# EAGLE design robot (EAGLE 6.4)
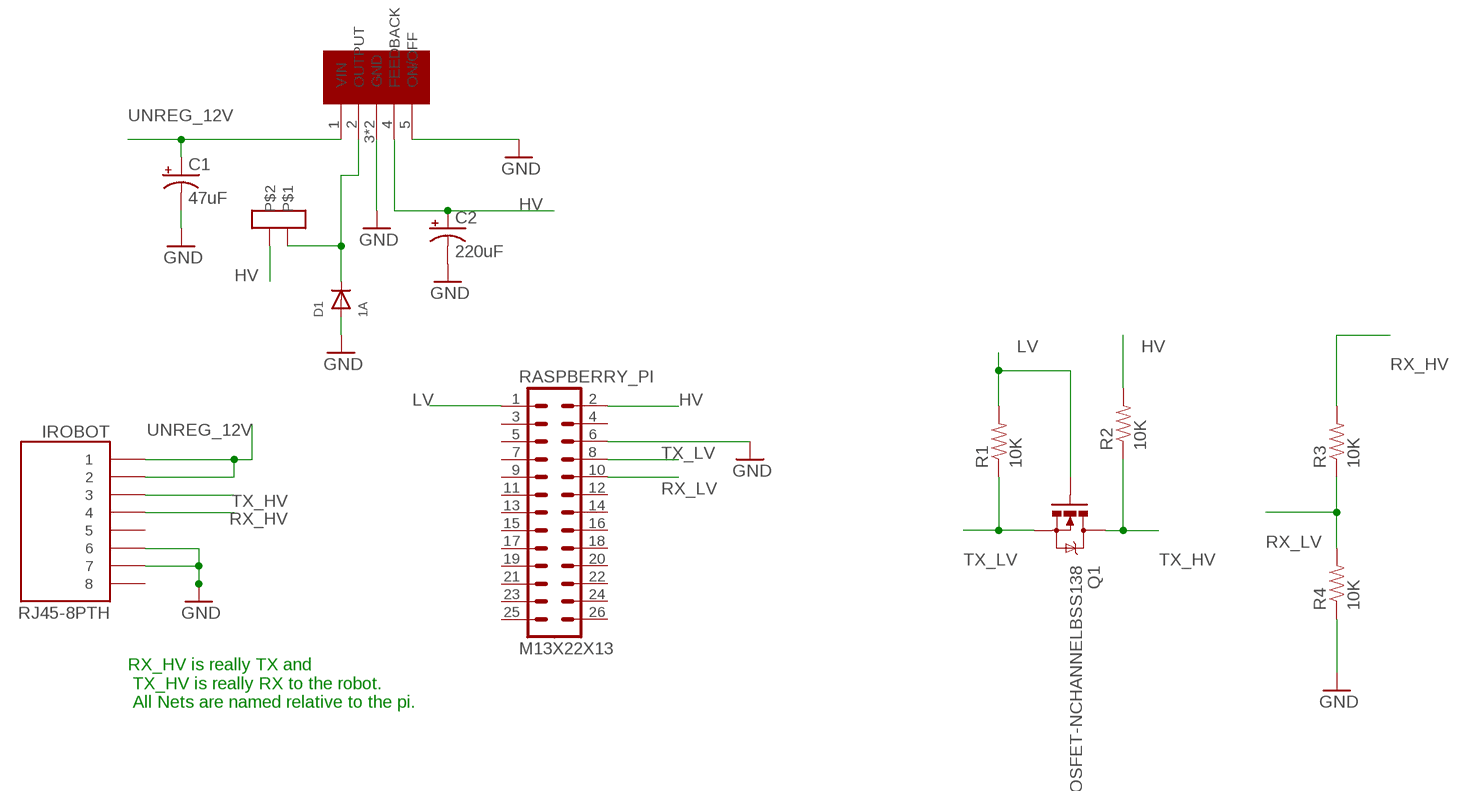
[diagram p0: schematic, sheet 1]

## Parts
C1  47uF  CAP_POLD  [PANASONIC_D]
C2  220uF  CAP_POLD  [PANASONIC_D]
D1  1A  DIODESOD-123  [SOD-123]
IROBOT  RJ45-8PTH  [RJ45-8]
Q1  MOSFET-NCHANNELBSS138  [SOT23]
R1  10K  RESISTOR0805-RES  [0805]
R2  10K  RESISTOR0805-RES  [0805]
R3  10K  RESISTOR0805-RES  [0805]
R4  10K  RESISTOR0805-RES  [0805]
RASPBERRY_PI  M13X22X13  [2X13]
U$1  TL2575  [TO-263]
U$2  PE-52627NL  [PE-52627NL]

## Nets
GND: C1.- C2.- D1.A IROBOT.6 IROBOT.7 R4.1 RASPBERRY_PI.6 U$1.3(GND) U$1.5(ON/OFF) U$1.6(GND)
HV: C2.+ R2.2 RASPBERRY_PI.2 U$1.4(FEEDBACK) U$2.P$2
LV: Q1.1(G) R1.2 RASPBERRY_PI.1
N$1: D1.C U$1.2(OUTPUT) U$2.P$1
RX_HV: IROBOT.4 R3.2
RX_LV: R3.1 R4.2 RASPBERRY_PI.10
TX_HV: IROBOT.3 Q1.3(D) R2.1
TX_LV: Q1.2(S) R1.1 RASPBERRY_PI.8
UNREG_12V: C1.+ IROBOT.1 IROBOT.2 U$1.1(VIN)
Unconnected: IROBOT.5 IROBOT.8 RASPBERRY_PI.3 RASPBERRY_PI.4 RASPBERRY_PI.5 RASPBERRY_PI.7 RASPBERRY_PI.9 RASPBERRY_PI.11 RASPBERRY_PI.12 RASPBERRY_PI.13 RASPBERRY_PI.14 RASPBERRY_PI.15 RASPBERRY_PI.16 RASPBERRY_PI.17 RASPBERRY_PI.18 RASPBERRY_PI.19 RASPBERRY_PI.20 RASPBERRY_PI.21 RASPBERRY_PI.22 RASPBERRY_PI.23 RASPBERRY_PI.24 RASPBERRY_PI.25 RASPBERRY_PI.26

## Notes on the sheet
- RX_HV is really TX and
   TX_HV is really RX to the robot.
   All Nets are named relative to the pi.

## Library data of the parts
C1 = SparkFun-Capacitors:CAP_POL: Capacitor Polarized These are standard SMD and PTH capacitors. Normally 10uF, 47uF, and 100uF in electrolytic and tantalum varieties. Always verify the external diameter of the through hole cap, it varies with capacity, voltage, and manufacturer. The EIA devices should be standard.
C2 = SparkFun-Passives:CAP_POL: Capacitor Polarized These are standard SMD and PTH capacitors. Normally 10uF, 47uF, and 100uF in electrolytic and tantalum varieties. Always verify the external diameter of the through hole cap, it varies with capacity, voltage, and manufacturer. The EIA devices should be standard.
D1 = adafruit:DIODE: Diode SMADIODE - SMA Surface Mount Package 20V 1A Schottky Diode Digikey: 641-1014-6-ND DO-1N4148 - Through Hole Small Current Diode SOD-123 20V 1 A (.5mV Vf) Schottky Diode - Digikey: MBRX120TPMSCT-ND SOD-323 10V 570mA (.38mV Vf, 3ns) Schottky Diode - Digikey: ZLLS410CT-ND SOD-523 30V 30mA Schottky Diode (RB751S-40TE61) - Digikey: RB751S-40TE61CT-ND SOT23-R/W - SOT23 Package (R = Solder Paste/Reflow Ovens, W = Hand-Soldering) BAT54Film 40V 300mA - Digikey: 497-7162-1-ND
IROBOT = SparkFun-Connectors:RJ45-8: RJ45 Jack Simple RJ45, 8-pin connection - connector for common Cat5, Cat5e, and Cat6 Ethernet cables. Footprint not yet proven in production. Connector sku is PRT-00643; Breakout PCB sku is BOB-00716.
Q1 = SparkFun-DiscreteSemi:MOSFET-NCHANNEL: Common NMOSFET Parts MFG P/N Store ID Prod ID FDD8780 TRANS-09984 SI7820DN TRANS-11055 FDS6630A IC-08089 2N7002PW TRANS-11151 FQP30N06L COM-10213 TRANS-10060 BSS123LT1G TRANS-08345 BSS138 TRANS-00830 BS170 2N7000; PROD_ID: TRANS-00830
R1-R4 = SparkFun-Resistors:RESISTOR: Resistor Basic schematic elements and footprints for 0603, 1206, and PTH resistors.
RASPBERRY_PI = SparkFun-Connectors:M13X2: 0.1" spaced headers
U$1 = TL2575:TL2575
U$2 = PE-52627NL:PE-52627NL

## Board
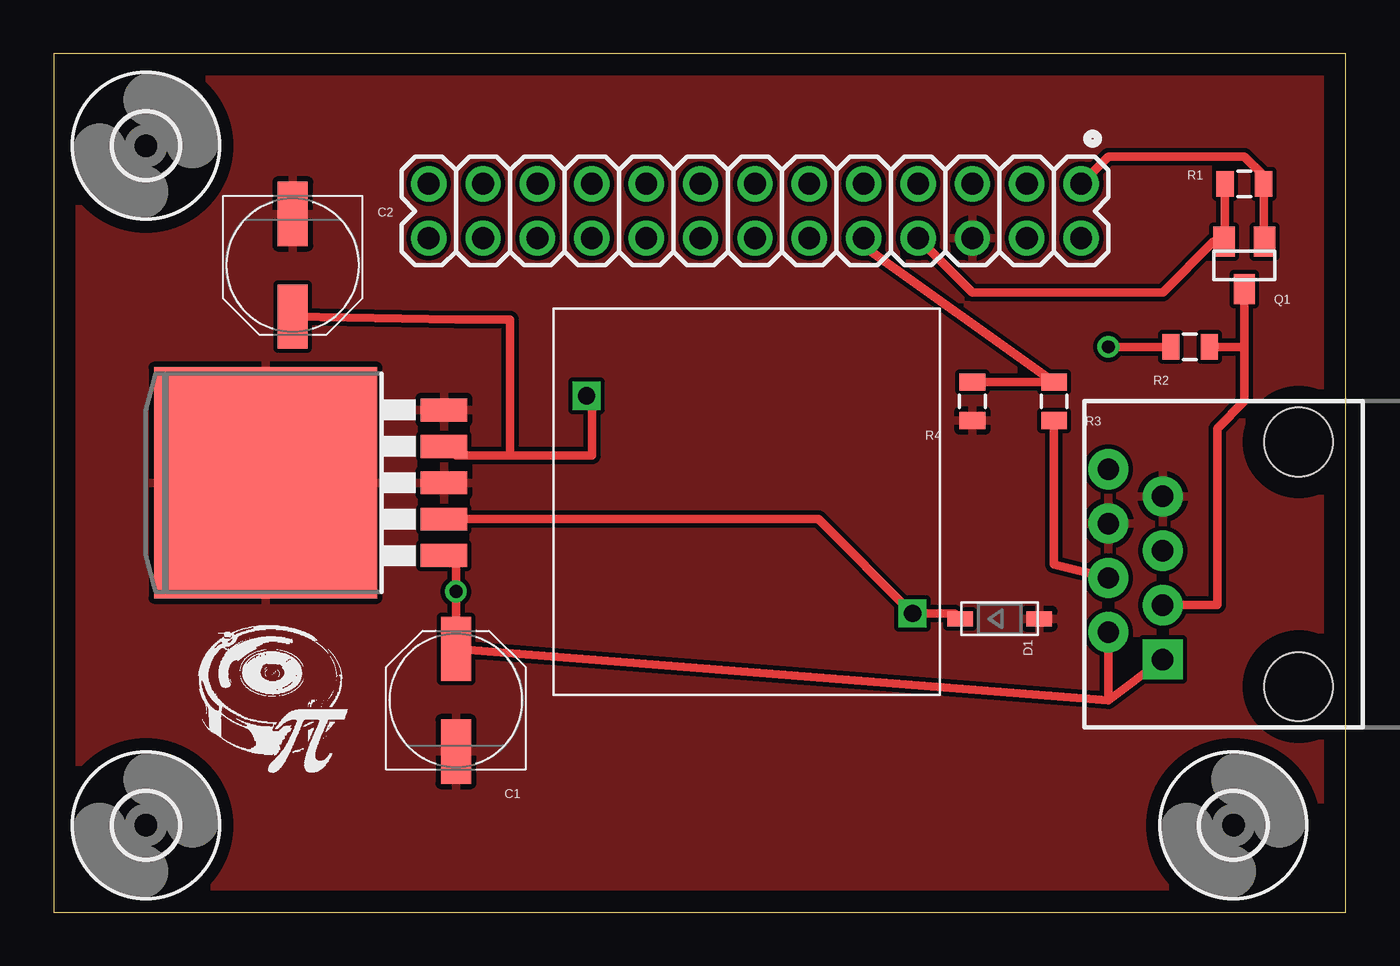
[diagram p1: board, top side]
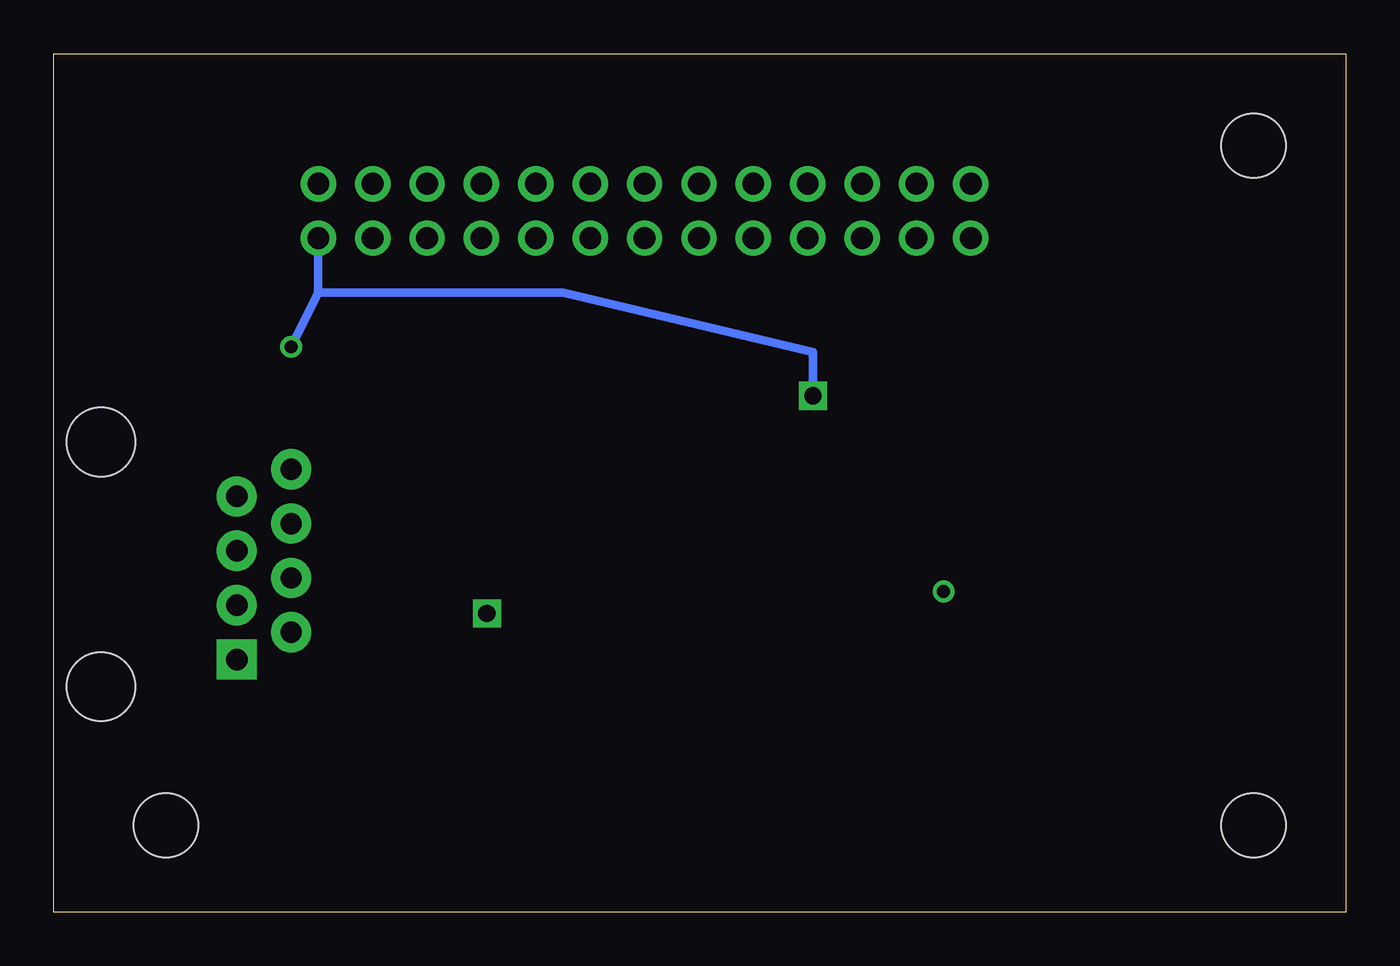
[diagram p2: board, bottom side, seen from below]

Size 60.38 x 40.12 mm. Coordinates in mm from the lower left corner, seen from the top.
Outline: 0,0 60.38,0 60.38,40.12 0,40.12 0,0
Copper layers (1*16): Top 0.035mm / dielectric 1.5mm / Bottom 0.035mm
Design rules "default": minimum track width 10mil, minimum drill 24mil, track to track 8mil, track to pad 8mil, pad to pad 8mil, via to via 8mil, smd to smd 8mil, copper to edge 40mil, drill to drill 8mil, minimum pad ring 10mil, minimum via ring 8mil, stop-mask expansion 4mil, vias tented up to drill 0mil, thermal gap 10mil

### Footprints (pad centres in the part's own frame; a part is rotated, then mirrored left to right if it is on the bottom)
PANASONIC_D = smd 3 x 1.4: + 2.4,0; - -2.4,0
SOD-123 = smd 1.2 x 0.7: A 1.85,0; C -1.85,0
RJ45-8 = drill 1 pad 1.88 square: 1 -4.445,6.35 | drill 1 pad 1.88: 2 -3.175,8.89; 3 -1.905,6.35; 4 -0.635,8.89; 5 0.635,6.35; 6 1.905,8.89; 7 3.175,6.35; 8 4.445,8.89 | hole 3.2: -5.715,0; 5.715,0
SOT23 = smd 1 x 1.4: 1 -0.95,-1.1; 2 0.95,-1.1; 3 0,1.1
0805 = smd 0.8 x 1.2: 1 -0.9,0; 2 0.9,0
2X13 = drill 1.016 pad 1.651: 1 0,0; 2 0,2.54; 3 2.54,0; 4 2.54,2.54; 5 5.08,0; 6 5.08,2.54; 7 7.62,0; 8 7.62,2.54; 9 10.16,0; 10 10.16,2.54; 11 12.7,0; 12 12.7,2.54; 13 15.24,0; 14 15.24,2.54; 15 17.78,0; 16 17.78,2.54; 17 20.32,0; 18 20.32,2.54; 19 22.86,0; 20 22.86,2.54; 21 25.4,0; 22 25.4,2.54; 23 27.94,0; 24 27.94,2.54; 25 30.48,0; 26 30.48,2.54
TO-263 = smd 1.067 x 2.159: 1 -3.404,-8.331; 2 -1.702,-8.331; 3 0,-8.331; 4 1.702,-8.331; 5 3.404,-8.331 | smd 10.8 x 10.41: 6 0,0
PE-52627NL = drill 0.8 square: P$1 -4.826,-7.366; P$2 5.334,7.874
3,0 = hole 3: 0,0

### Placement (x,y rotation side)
C1  18.8,9.91 90 top
C2  11.18,30.23 270 top
D1  44.2,13.72 0 top
IROBOT  58.17,16.26 90 top
Q1  55.63,30.23 180 top
R1  55.63,34.04 0 top
R2  53.09,26.42 180 top
R3  46.74,23.88 270 top
R4  42.93,23.88 90 top
RASPBERRY_PI  48.01,34.04 180 top
U$1  9.91,20.07 90 top
U$2  32.77,18.8 90 top
U$3  [3,0]  4.32,35.81 0 top
U$5  [3,0]  4.32,4.06 0 top
U$6  [3,0]  55.12,4.06 0 top

### Tracks (layer width: path | path; a pad name or v marks a point on that pad's centre or on a via)
GND
  pour Top: -5.33,41.66 -5.33,-12.95 -4.06,-14.22 63.25,-14.22 63.25,41.66
HV  (via drill 0.6)
  Top 0.254: 18.8,21.34 U$1.4
  Top 0.406: 21.34,21.34 25.15,21.34 25.15,23.88 U$2.P$2 | 21.34,21.34 18.8,21.34 | 21.34,21.34 21.34,27.69 18.8,27.69 C2.+ | R2.2 v49.28,26.42
  Bottom 0.254: 25.15,23.88 U$2.P$2
  Bottom 0.406: v49.28,26.42 48.01,28.96 | 48.01,28.96 RASPBERRY_PI.2 | 48.01,28.96 36.58,28.96 24.89,26.16 U$2.P$2
LV
  Top 0.254: 56.9,31.5 Q1.1
  Top 0.406: Q1.1 56.53,31.38 R1.2 56.53,34.41 55.63,35.31 49.28,35.31 RASPBERRY_PI.1
N$1
  Top 0.406: U$1.2 35.74,18.36 U$2.P$1 42.09,13.97 D1.C
RX_HV
  Top 0.406: R3.2 46.74,16.26 IROBOT.4
RX_LV
  Top 0.406: R4.2 R3.1 37.85,31.13 RASPBERRY_PI.10
TX_HV
  Top 0.406: IROBOT.3 54.36,14.35 54.36,22.61 55.63,23.88 55.63,26.42 | Q1.3 55.63,26.42 | 55.63,26.42 R2.1
TX_LV
  Top 0.406: R1.1 54.73,31.38 Q1.2 54.19,31.33 51.82,28.96 42.93,28.96 RASPBERRY_PI.8
UNREG_12V  (via drill 0.61)
  Top 0.254: 18.8,16.26 U$1.1
  Top 0.406: 18.8,16.26 v18.8,14.99 C1.+ 49.28,9.91 | 49.28,9.91 IROBOT.2 | IROBOT.1 49.28,9.91

### Text on the board
tPlace: /Users/tcasselman/code/pi/fido_pi/graphic.bmp